# EAGLE design Varta_Replacer_Rev1 (EAGLE 9.7.0)
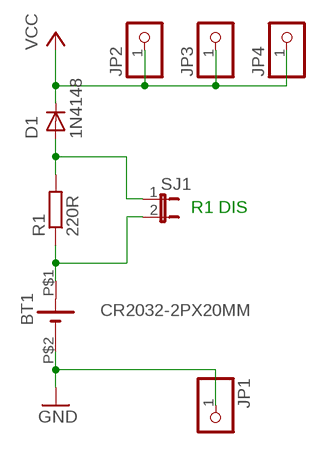
[diagram p0: schematic, sheet 1]

## Parts
BT1  CR2032-2PX20MM  [CR2032_2PX20]
D1  1N4148  DIODEDO-1N4148  [DO-1N4148]
JP1  PINHD-1X1  [1X01]
JP2  PINHD-1X1  [1X01]
JP3  PINHD-1X1  [1X01]
JP4  PINHD-1X1  [1X01]
R1  220R  R-EU_0207/10  [0207/10]
SJ1  JUMPER-2SJ  [SJ-2]

## Nets
BAT+: BT1.P$1(+) R1.1 SJ1.2
GND: BT1.P$2(-) JP1.1
N$2: D1.A R1.2 SJ1.1
VCC: D1.C JP2.1 JP3.1 JP4.1

## Notes on the sheet
- R1 DIS

## Library data of the parts
BT1 = Per (Fusion 360):CR2032
D1 = adafruit:DIODE: Diode SMADIODE - SMA Surface Mount Package 20V 1A Schottky Diode Digikey: 641-1014-6-ND DO-1N4148 - Through Hole Small Current Diode SOD-123 20V 1 A (.5mV Vf) Schottky Diode - Digikey: MBRX120TPMSCT-ND SOD-323 10V 570mA (.38mV Vf, 3ns) Schottky Diode - Digikey: ZLLS410CT-ND SOD-523 30V 30mA Schottky Diode (RB751S-40TE61) - Digikey: RB751S-40TE61CT-ND SOT23-R/W - SOT23 Package (R = Solder Paste/Reflow Ovens, W = Hand-Soldering) BAT54Film 40V 300mA - Digikey: 497-7162-1-ND
JP1-JP4 = adafruit:PINHD-1X1: Pin header 1x1 for 0.1" spacing With round pins
R1 = rcl:R-EU_: RESISTOR, European symbol; SPICEPREFIX: R
SJ1 = Per (Fusion 360):JUMPER-2

## Board
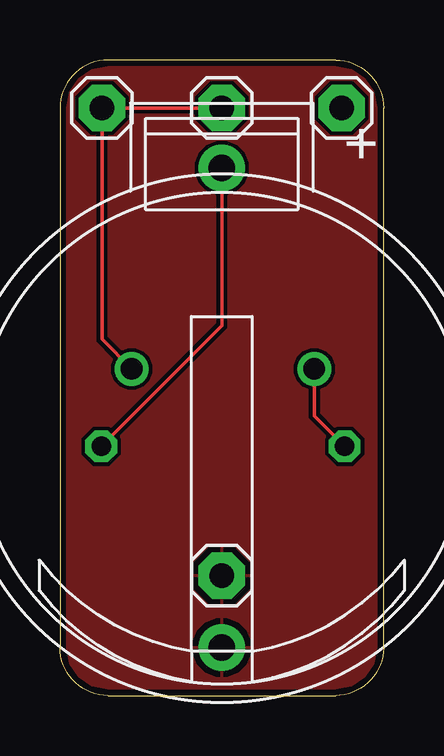
[diagram p1: board, top side]
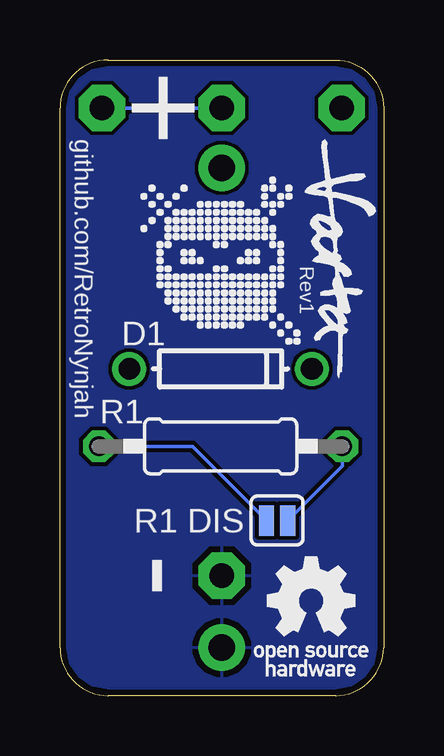
[diagram p2: board, bottom side, seen from below]

Size 13.5 x 26.5 mm. Coordinates in mm from the lower left corner, seen from the top.
Outline: 2,0 11.5,0 arc90 13.5,2 13.5,24.5 arc90 11.5,26.5 2,26.5 arc90 0,24.5 0,2 arc90 2,0
Copper layers (1*16): Top 0.035mm / dielectric 1.5mm / Bottom 0.035mm
Design rules "SeeedStudio_2layer_DRU_no_angle_20140221": minimum track width 6mil, minimum drill 12mil, track to track 6mil, track to pad 6mil, pad to pad 6mil, via to via 6mil, smd to smd 0mil, copper to edge 10mil, drill to drill 10mil, minimum pad ring 10mil, minimum via ring 6mil, stop-mask expansion 2mil, vias tented up to drill 100mil, thermal gap 10mil

### Footprints (pad centres in the part's own frame; a part is rotated, then mirrored left to right if it is on the bottom)
CR2032_2PX20 = drill 1.1 pad 1.93: P$1 0,10; P$2 0,-10
DO-1N4148 = drill 0.9: A -3.81,0; C 3.81,0
1X01 = drill 1.016 pad 1.93 octagon: 1 0,0
0207/10 = drill 0.813 octagon: 1 -5.08,0; 2 5.08,0
SJ-2 = smd 0.635 x 1.27: 1 -0.889,0; 2 0,0

### Placement (x,y rotation side)
!VARTA  [!VARTA_10X3]  3.3,23.2 270 bottom
BT1  6.75,12 0 top
D1  6.8,13.62 0 bottom
JP1  6.75,5 0 top
JP2  1.75,24.5 0 top
JP3  6.75,24.5 0 top
JP4  11.75,24.5 0 top
R1  6.8,10.39 180 bottom
SJ1  4,7.3 0 bottom
U$1  [RETRONINJA_NOTEXT_7MM]  6.8,18.3 0 bottom
U$2  [OSHW_5MM]  5.4,0.8 0 bottom

### Tracks (layer width: path | path; a pad name or v marks a point on that pad's centre or on a via)
BAT+
  Top 0.152: R1.1 6.75,15.42 BT1.P$1
  Bottom 0.152: SJ1.2 1.72,9.58 R1.1
GND
  pour Bottom: 0,26.5 0,0 13.5,0 13.5,26.5
  pour Top: 0,26.5 0,0 13.5,0 13.5,26.5
N$2
  Top 0.152: R1.2 10.61,11.66 D1.A
  Bottom 0.152: SJ1.1 7.98,10.39 R1.2
VCC
  Top 0.152: D1.C 1.75,14.86 JP2.1 JP3.1
  Bottom 0.152: JP4.1 JP3.1

### Text on the board
bPlace: + | github.com/RetroNynjah | Rev1 | R1 DIS | -